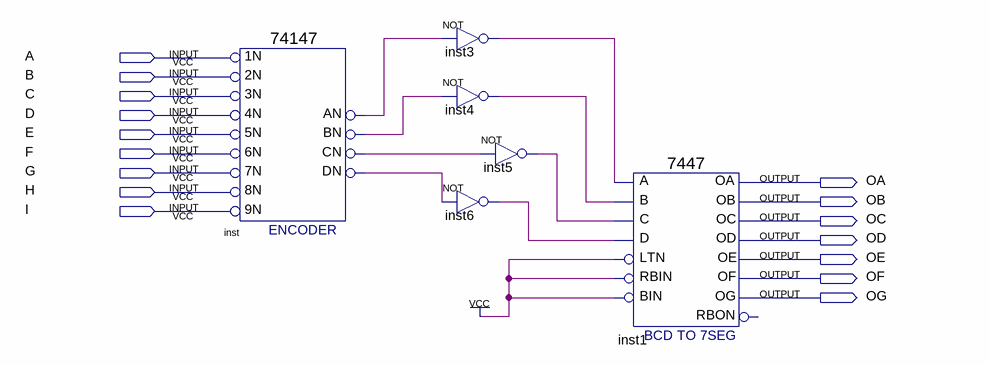
[diagram p0: schematic sheet]
// Quartus schematic THR2023063114_2.bdf as structural Verilog: 6 symbols, 16 pins
module THR2023063114_2 (
  input  A,
  input  B,
  input  C,
  input  D,
  input  E,
  input  F,
  input  G,
  input  H,
  input  I,
  output OA,
  output OB,
  output OC,
  output OD,
  output OE,
  output OF,
  output OG
);

  wire inst3_out, inst4_out, inst5_out, inst6_out, inst_an, inst_bn, inst_cn, inst_dn;

  \74147  inst (
    .\1N (A), .\2N (B), .\3N (C), .\6N (F), .\5N (E), .\4N (D), .\9N (I), .\8N (H), .\7N (G), .CN(inst_cn),
    .BN(inst_bn), .AN(inst_an), .DN(inst_dn));
  not inst3 (inst3_out, inst_an);
  not inst4 (inst4_out, inst_bn);
  not inst6 (inst6_out, inst_dn);
  not inst5 (inst5_out, inst_cn);
  \7447  inst1 (
    .LTN(1'b1), .B(inst4_out), .C(inst5_out), .D(inst6_out), .RBIN(1'b1), .BIN(1'b1), .A(inst3_out), .OB(OB),
    .OC(OC), .OE(OE), .OD(OD), .OF(OF), .OG(OG), .OA(OA));  // open: RBON
endmodule
